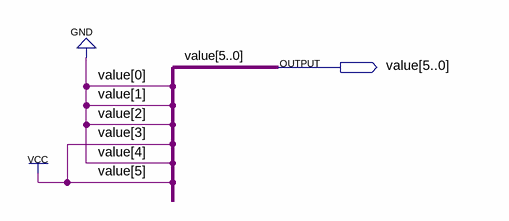
[diagram p0: schematic sheet]
// Quartus schematic dec_5_6bit.bdf as structural Verilog: 0 symbols, 1 pins
module dec_5_6bit (
  output [5:0] value
);


  assign value = 6'b101000;
endmodule
